# Altium project 智能睡眠枕工程.PrjPcb
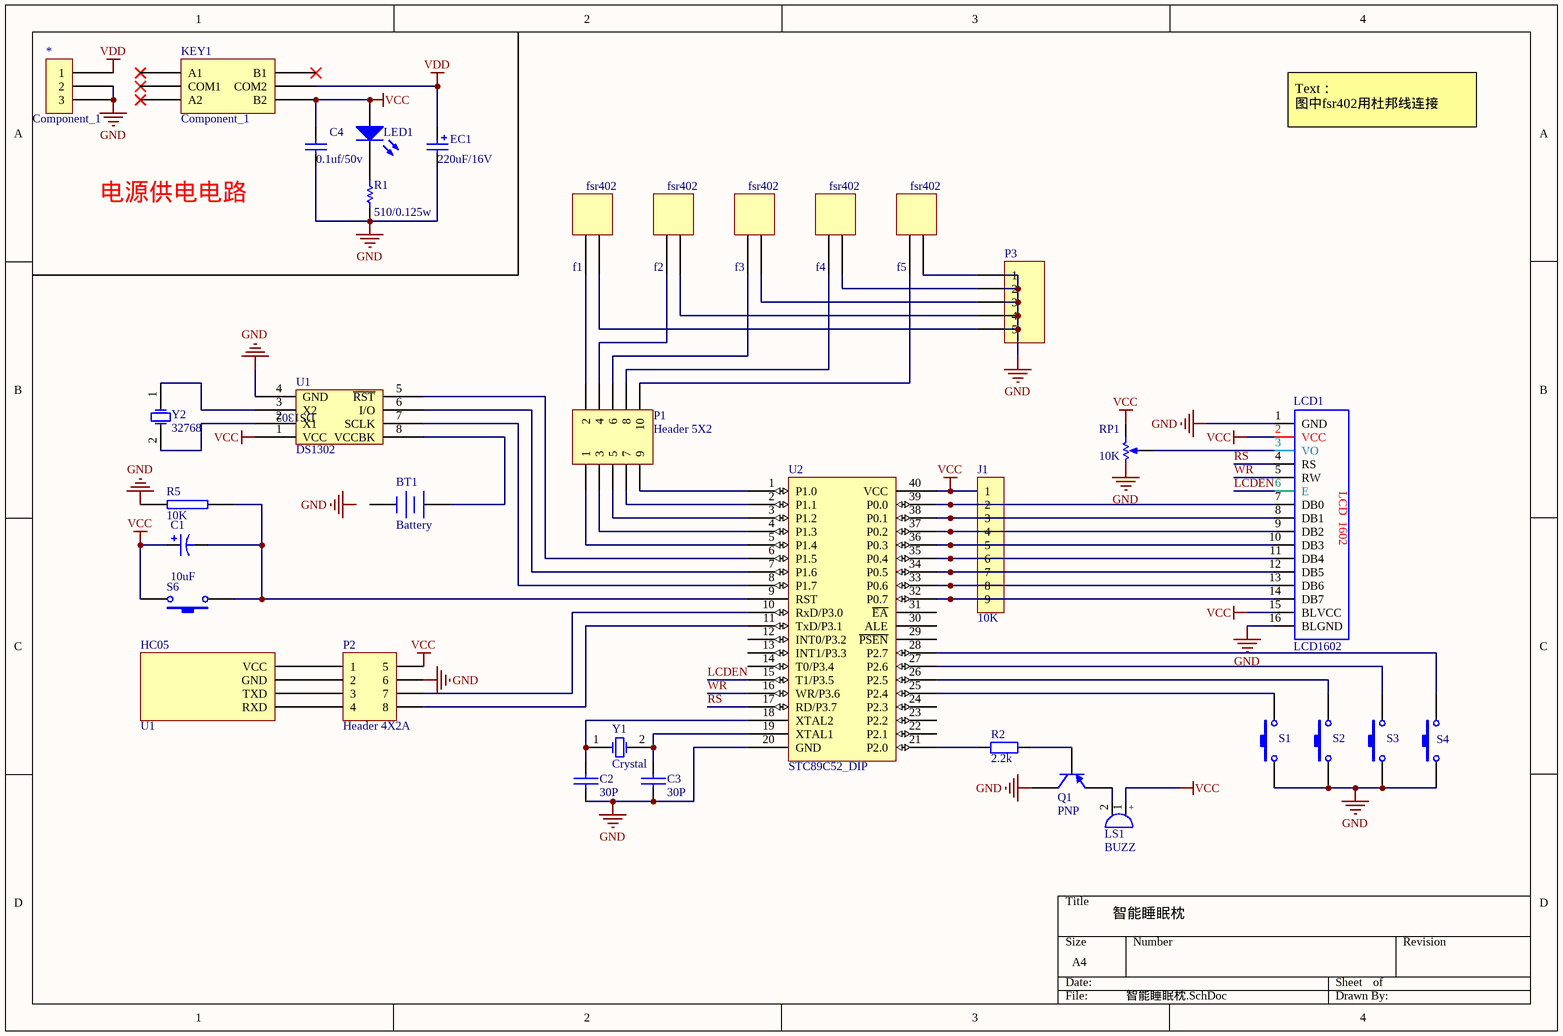
[diagram p0: 智能睡眠枕.SchDoc]
1 sheet, 35 parts. Net scope: global (net labels, ports and power ports of the same name join across sheets).
Board file: 智能睡眠枕.PcbDoc

## Sheet 智能睡眠枕.SchDoc: 智能睡眠枕
size A4; Author: 孙易泽

### Parts
*  Component_1  [PCBComponent_1]
BT1  Battery  [BAT-2]
C1  value 10uF  [C0805]  (hidden comment: Cap Pol3)
C2  30P  [Capacitor-Disk-Small]
C3  30P  [Capacitor-Disk-Small]
C4  value 0.1uf/50v  [RAD-0.3]  (hidden comment: Cap)
EC1  value 220uF/16V  [Capacitor-Disk-Middle]  (hidden comment: Cap Pol2)
f1  fsr402  [PCBComponent_1]
f2  fsr402  [PCBComponent_1]
f3  fsr402  [PCBComponent_1]
f4  fsr402  [PCBComponent_1]
f5  fsr402  [PCBComponent_1]
HC05  U1  [HC-0x]
J1  10K  [RES-PACK-DIP9]
KEY1  Component_1  [PCBComponent_1 - duplicate1]
LCD1  LCD1602  [LCD1602]
LED1  LED Chip  [CLED1005-0402]  (value not drawn)
LS1  BUZZ  [BUZZER_12*9.5]
P1  Header 5X2  [HDR2X5]
P2  Header 4X2A  [HDR2X4_CEN]
P3  Header 5H  [HDR1X5H]  (value not drawn)
Q1  PNP  [SOT-23B_N]
R1  value 510/0.125w  [AXIAL-0.3]  (hidden comment: Res1)
R2  2.2k  [AXIAL-0.4-R]
R5  10K  [AXIAL-0.3]
RP1  value 10K  [VR5]  (hidden comment: RPot)
S1  Tactile Switch  [BUTTON_6*6]  (value not drawn)
S2  Tactile Switch  [BUTTON_6*6]  (value not drawn)
S3  Tactile Switch  [BUTTON_6*6]  (value not drawn)
S4  Tactile Switch  [BUTTON_6*6]  (value not drawn)
S6  Tactile Switch  [BUTTON_6*6]  (value not drawn)
U1  DS1302  [DIP-8]
U2  STC89C52_DIP  [DIP-40]
Y1  Crystal  [cry卧式]
Y2  32768  [cry卧式]

### Nets
GND: *.2 *.3 C2.1 C3.1 C4.1 EC1.2 LCD1.1(GND) LCD1.16(BLGND) P2.6 Q1.1(C) R1.1 R5.1 S1.2 S2.2 S3.2 S4.2 U1.4(GND) U2.20(GND)
VCC: C1.1 C4.2 J1.1 KEY1.6(B2) LCD1.2(VCC) LCD1.15(BLVCC) LED1.1(A) LS1.1 P2.5 RP1.1(TOP) S6.1 U1.1(VCC) U2.40(VCC)
VDD: *.1 EC1.1 KEY1.5(COM2)
LCDEN: LCD1.6(E) U2.15(T1/P3.5)
RS: LCD1.4(RS) U2.17(RD/P3.7)
WR: LCD1.5(RW) U2.16(WR/P3.6)
NetBT1_1: BT1.1(+) U1.8(VCCBK)
NetC1_2: C1.2 R5.2 S6.2 U2.9(RST)
NetC2_2: C2.2 U2.18(XTAL2) Y1.1(OSC1)
NetC3_2: C3.2 U2.19(XTAL1) Y1.2(OSC2)
NetHC05_16: HC05.16(RXD) P2.4
NetHC05_17: HC05.17(TXD) P2.3
NetHC05_18: HC05.18(GND) P2.2
NetHC05_19: HC05.19(VCC) P2.1
NetJ1_2: J1.2 LCD1.7(DB0) U2.39(P0.0)
NetJ1_3: J1.3 LCD1.8(DB1) U2.38(P0.1)
NetJ1_4: J1.4 LCD1.9(DB2) U2.37(P0.2)
NetJ1_5: J1.5 LCD1.10(DB3) U2.36(P0.3)
NetJ1_6: J1.6 LCD1.11(DB4) U2.35(P0.4)
NetJ1_7: J1.7 LCD1.12(DB5) U2.34(P0.5)
NetJ1_8: J1.8 LCD1.13(DB6) U2.33(P0.6)
NetJ1_9: J1.9 LCD1.14(DB7) U2.32(P0.7)
NetLCD1_3: LCD1.3(VO) RP1.3(TAP)
NetLED1_2: LED1.2(K) R1.2
NetLS1_2: LS1.2 Q1.3(E)
NetP1_1: P1.1 U2.5(P1.4)
NetP1_3: P1.3 U2.4(P1.3)
NetP1_5: P1.5 U2.3(P1.2)
NetP1_7: P1.7 U2.2(P1.1)
NetP1_9: P1.9 U2.1(P1.0)
NetP2_7: P2.7 U2.10(RxD/P3.0)
NetP2_8: P2.8 U2.11(TxD/P3.1)
NetQ1_2: Q1.2(B) R2.1
NetR2_2: R2.2 U2.21(P2.0)
NetS1_1: S1.1 U2.25(P2.4)
NetS2_1: S2.1 U2.26(P2.5)
NetS3_1: S3.1 U2.27(P2.6)
NetS4_1: S4.1 U2.28(P2.7)
NetU1_2: U1.2(X1) Y2.2(OSC2)
NetU1_3: U1.3(X2) Y2.1(OSC1)
NetU1_5: U1.5(~{RST}) U2.6(P1.5)
NetU1_6: U1.6(I/O) U2.7(P1.6)
NetU1_7: U1.7(SCLK) U2.8(P1.7)

Not connected (* = marked no-connect by the designer): BT1 2(-); f1 0 1; f2 0 1; f3 0 1; f4 0 1; f5 0 1; KEY1 1(A1)* 2(COM1)* 3(A2)* 4(B1)*; P1 2 4 6 8 10; P3 1 2 3 4 5; RP1 2(BOT); U2 12(INT0/P3.2) 13(INT1/P3.3) 14(T0/P3.4) 22(P2.1) 23(P2.2) 24(P2.3) 29(~{PSEN}) 30(ALE) 31(~{EA})

### Notes on the sheet
- Text：
  图中fsr402用杜邦线连接
- 电源供电电路
- Labels drawn without touching a wire or pin: GND
- (in symbol BUZZ) +
- (in symbol LCD1602) LCD  1602

### Library data of the parts
BT1 = Battery: Multicell Battery; Published: 24-Mar-1999; LatestRevisionDate: 17-Jul-2002; LatestRevisionNote: Re-released for DXP Platform.; PackageReference: BAT-2; Publisher: Altium Limited; PackageDescription: Battery; 2 Leads
C1 = Cap Pol3: Polarized Capacitor (Surface Mount); Published: 8-Jun-2000; LatestRevisionDate: 29-May-2009; LatestRevisionNote: IPC-7351 Footprint Added.; PackageReference: C0805; Publisher: Altium Limited; PackageDescription: Chip Capacitor
C2 C3 = CAP: Capacitor
C4 = Cap: Capacitor; Published: 8-Jun-2000; LatestRevisionDate: 17-Jul-2002; LatestRevisionNote: Re-released for DXP Platform.; PackageReference: RAD-0.3; Publisher: Altium Limited; PackageDescription: Radial Cap, Thru-Hole; 2 Leads; 0.3 in Pin Spacing
EC1 = Cap Pol2: Polarized Capacitor (Axial); Published: 8-Jun-2000; LatestRevisionDate: 17-Jul-2002; LatestRevisionNote: Re-released for DXP Platform.; PackageReference: POLAR0.8; Publisher: Altium Limited; PackageDescription: Polarized Capacitor; 2 Leads
f1-f5 = COMPONENT_1
HC05 = Component_1
J1 = CON9: Connector
LED1 = LED Chip: Typical Chip LED; Published: 8-Jun-2000; Revision: July-2002: Re-released for DXP Platform.; Publisher: Altium Limited
LS1 = BUZZ: 蜂鸣器
P1 = Header 5X2: Header, 5-Pin, Dual row; LatestRevisionDate: 17-Jul-2002; LatestRevisionNote: Re-released for DXP Platform.; Publisher: Altium Limited
P2 = Header 4X2A: Header, 4-Pin, Dual row; LatestRevisionDate: 17-Jul-2002; LatestRevisionNote: Re-released for DXP Platform.; Publisher: Altium Limited
P3 = Header 5H: Header, 5-Pin, Right Angle; LatestRevisionDate: 17-Jul-2002; LatestRevisionNote: Re-released for DXP Platform.; Publisher: Altium Limited
Q1 = PNP: PNP Bipolar Transistor; Published: 8-Jun-2000; LatestRevisionDate: 29-May-2009; LatestRevisionNote: IPC-7351 Footprint Added.; PackageVersion: Aug-1999; PackageReference: SOT-23B; Publisher: Altium Limited; PackageDescription: 3-Pin SOT-23 Package 0.95 mm Pitch, 2.4 mm Lead Span
R1 = Res1: Resistor; Published: 8-Jun-2000; LatestRevisionDate: 17-Jul-2002; LatestRevisionNote: Re-released for DXP Platform.; PackageReference: AXIAL-0.3; Publisher: Altium Limited; PackageDescription: Axial Device, Thru-Hole; 2 Leads; 0.3 in Pin Spacing
R2 = Res2_1/4W: Resistor 直插电阻 0.25W; Published: 8-Jun-2000; LatestRevisionDate: 17-Jul-2002; LatestRevisionNote: Re-released for DXP Platform.; PackageReference: AXIAL-0.4; Publisher: Altium Limited; Value: 2.2k
R5 = RES2
RP1 = RPot: Potentiometer; Sim Note: Enter the Resistance value and the set point into parameter fields.; Set Position: 0.5; Published: 8-Jun-2000; LatestRevisionDate: 17-Jul-2002; LatestRevisionNote: Re-released for DXP Platform.; PackageReference: VR5; Publisher: Altium Limited; PackageDescription: Variable Resistor, Thru-Hole; 3 Leads
S1-S4 S6 = SW-PB: Tactile Switch触觉开关; Published: 24-Mar-1999; LatestRevisionDate: 17-Jul-2002; LatestRevisionNote: Re-released for DXP Platform.; PackageReference: SPST-2; Publisher: Altium Limited
U1 = DS1302: Clock
Y1 = Crystal 11.05292/12/16/24/MHz: 直插晶振11.05292/12/16/24/MHz
Y2 = Crystal 11.05292/12/16/24/MHz_1: 柱状晶振32.768kHz